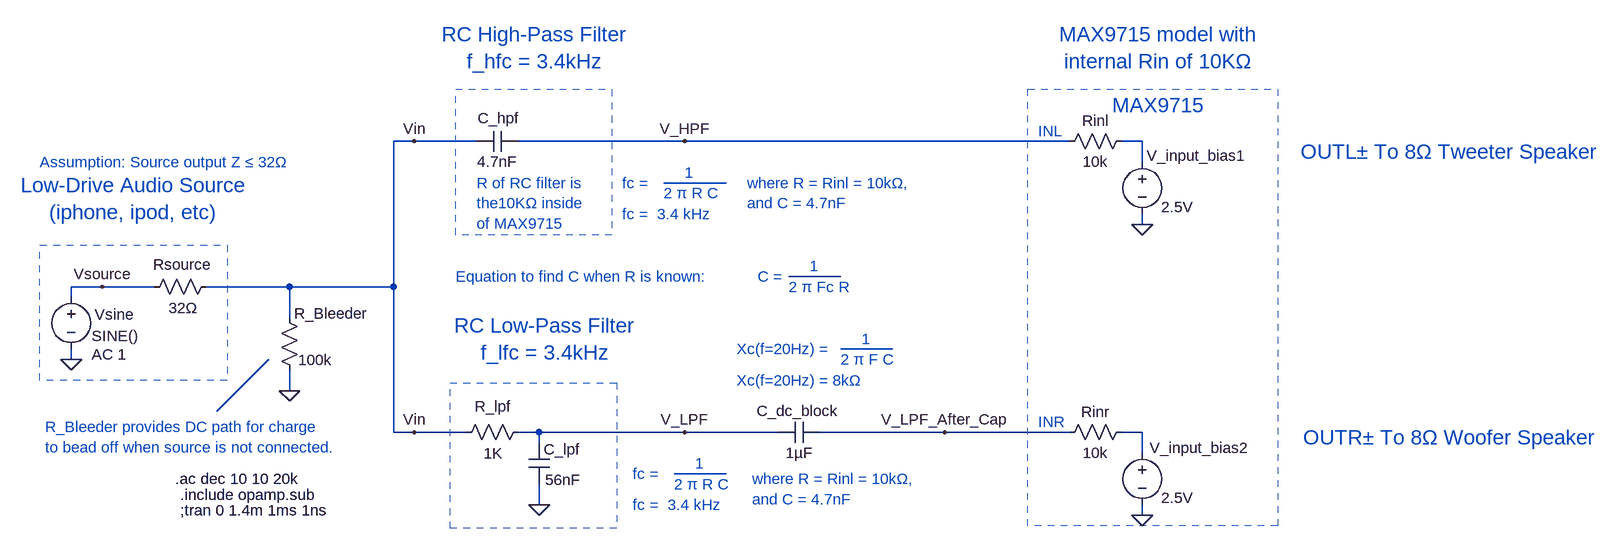
[diagram p0: schematic audio-crossover.asc]
audio-crossover.asc, the LTspice schematic file:
Version 4
SHEET 1 2344 2400
WIRE -1104 1648 -1136 1648
WIRE -1008 1648 -1104 1648
WIRE -688 1648 -944 1648
WIRE -96 1648 -688 1648
WIRE 16 1648 -16 1648
WIRE 16 1680 16 1648
WIRE -624 1712 -720 1712
WIRE 16 1776 16 1760
WIRE -448 1856 -528 1856
WIRE -1584 1872 -1632 1872
WIRE -1504 1872 -1584 1872
WIRE -1296 1872 -1424 1872
WIRE -1136 1872 -1136 1648
WIRE -1136 1872 -1296 1872
WIRE -1632 1888 -1632 1872
WIRE -1296 1920 -1296 1872
WIRE -368 1968 -448 1968
WIRE -1632 1984 -1632 1968
WIRE -1296 2032 -1296 2000
WIRE -1408 2064 -1328 1984
WIRE -1136 2096 -1136 1872
WIRE -1104 2096 -1136 2096
WIRE -1024 2096 -1104 2096
WIRE -912 2096 -944 2096
WIRE -688 2096 -912 2096
WIRE -544 2096 -688 2096
WIRE -288 2096 -480 2096
WIRE -96 2096 -288 2096
WIRE 16 2096 -16 2096
WIRE -912 2112 -912 2096
WIRE 16 2128 16 2096
WIRE -624 2160 -704 2160
WIRE -912 2208 -912 2176
WIRE 16 2224 16 2208
FLAG -912 2208 0
FLAG -1632 1984 0
FLAG -1584 1872 Vsource
FLAG 16 1776 0
FLAG -1104 1648 Vin
FLAG -688 1648 V_HPF
FLAG -1104 2096 Vin
FLAG -688 2096 V_LPF
FLAG -1296 2032 0
FLAG 16 2224 0
FLAG -288 2096 V_LPF_After_Cap
SYMBOL cap -928 2112 R0
WINDOW 3 25 57 Left 2
WINDOW 0 23 10 Left 2
SYMATTR Value 56nF
SYMATTR InstName C_lpf
SYMBOL res -928 2080 R90
WINDOW 0 -8 55 VBottom 2
WINDOW 3 33 55 VTop 2
SYMATTR InstName R_lpf
SYMATTR Value 1K
SYMBOL voltage -1632 1872 R0
WINDOW 0 36 43 Left 2
WINDOW 3 32 76 Left 2
WINDOW 123 32 104 Left 2
WINDOW 39 0 0 Left 0
SYMATTR InstName Vsine
SYMATTR Value SINE()
SYMATTR Value2 AC 1
SYMBOL res -1408 1856 R90
WINDOW 0 -3 53 VBottom 2
WINDOW 3 33 51 VTop 2
SYMATTR InstName Rsource
SYMATTR Value 32Ω
SYMBOL cap -944 1632 R90
WINDOW 3 32 32 VTop 2
WINDOW 0 -4 30 VBottom 2
SYMATTR Value 4.7nF
SYMATTR InstName C_hpf
SYMBOL cap -480 2080 R90
WINDOW 0 -1 34 VBottom 2
WINDOW 3 32 32 VTop 2
SYMATTR InstName C_dc_block
SYMATTR Value 1µF
SYMBOL res -1312 1904 R0
WINDOW 0 23 9 Left 2
WINDOW 3 29 81 Left 2
SYMATTR InstName R_Bleeder
SYMATTR Value 100k
SYMBOL res 0 1632 R90
WINDOW 0 0 56 VBottom 2
WINDOW 3 32 56 VTop 2
SYMATTR InstName Rinl
SYMATTR Value 10k
SYMBOL voltage 16 1664 R0
WINDOW 0 7 6 Left 2
WINDOW 3 29 85 Left 2
WINDOW 123 0 0 Left 0
WINDOW 39 0 0 Left 0
SYMATTR InstName V_input_bias1
SYMATTR Value 2.5V
SYMBOL res 0 2080 R90
WINDOW 0 0 56 VBottom 2
WINDOW 3 32 56 VTop 2
SYMATTR InstName Rinr
SYMATTR Value 10k
SYMBOL voltage 16 2112 R0
WINDOW 0 11 8 Left 2
WINDOW 3 29 85 Left 2
WINDOW 123 0 0 Left 0
WINDOW 39 0 0 Left 0
SYMATTR InstName V_input_bias2
SYMATTR Value 2.5V
TEXT 40 1504 Center 3 ;MAX9715 model with\ninternal Rin of 10KΩ
TEXT -1536 1736 Center 3 ;Low-Drive Audio Source\n(iphone, ipod, etc)
TEXT -920 1504 Center 3 ;RC High-Pass Filter\nf_hfc = 3.4kHz
TEXT -784 1712 Left 2 ;fc =
TEXT -688 1696 Left 2 ;1
TEXT -720 1728 Left 2 ;2 π R C
TEXT -784 1760 Left 2 ;fc =  3.4 kHz
TEXT 40 1592 Center 3 ;MAX9715
TEXT 488 1664 Center 3 ;OUTL± To 8Ω Tweeter Speaker
TEXT -1472 2168 Left 2 !.ac dec 10 10 20k
TEXT -1464 2192 Left 2 !.include opamp.sub
TEXT -1464 2216 Left 2 !;tran 0 1.4m 1ms 1ns
TEXT -904 1952 Center 3 ;RC Low-Pass Filter\nf_lfc = 3.4kHz
TEXT -768 2160 Left 2 ;fc =
TEXT -672 2144 Left 2 ;1
TEXT -704 2176 Left 2 ;2 π R C
TEXT -768 2208 Left 2 ;fc =  3.4 kHz
TEXT 488 2104 Center 3 ;OUTR± To 8Ω Woofer Speaker
TEXT -608 1968 Left 2 ;Xc(f=20Hz) =
TEXT -448 1984 Left 2 ;2 π F C
TEXT -416 1952 Left 2 ;1
TEXT -608 2016 Left 2 ;Xc(f=20Hz) = 8kΩ
TEXT -1672 2088 Left 2 ;R_Bleeder provides DC path for charge\nto bead off when source is not connected.
TEXT -144 1632 Left 2 ;INL
TEXT -144 2080 Left 2 ;INR
TEXT -592 1712 Left 2 ;where R = Rinl = 10kΩ,\nand C = 4.7nF
TEXT -1008 1712 Left 2 ;R of RC filter is\nthe10KΩ inside\nof MAX9715
TEXT -584 2168 Left 2 ;where R = Rinl = 10kΩ,\nand C = 4.7nF
TEXT -1040 1856 Left 2 ;Equation to find C when R is known:
TEXT -576 1856 Left 2 ;C =
TEXT -528 1872 Left 2 ;2 π Fc R
TEXT -496 1840 Left 2 ;1
TEXT -1680 1680 Left 2 ;Assumption: Source output Z ≤ 32Ω
LINE Normal -1552 1808 -1552 1808 2
LINE Normal -1552 1808 -1552 1808 2
RECTANGLE Normal -1392 2016 -1680 1808 2
RECTANGLE Normal -800 1792 -1040 1568 2
RECTANGLE Normal 224 2240 -160 1568 2
RECTANGLE Normal -793 2244 -1049 2020 2

The netlist it stands for:
* audio-crossover.asc
C_lpf V_LPF 0 56nF
R_lpf V_LPF Vin 1K
Vsine Vsource 0 SINE() AC 1
Rsource Vin Vsource 32Ω
C_hpf V_HPF Vin 4.7nF
C_dc_block V_LPF_After_Cap V_LPF 1µF
R_Bleeder Vin 0 100k
Rinl N001 V_HPF 10k
V_input_bias1 N001 0 2.5V
Rinr N006 V_LPF_After_Cap 10k
V_input_bias2 N006 0 2.5V
* MAX9715 model with
* internal Rin of 10KΩ
* Low-Drive Audio Source
* (iphone, ipod, etc)
* RC High-Pass Filter
* f_hfc = 3.4kHz
* fc =
* 1
* 2 π R C
* fc =  3.4 kHz
* MAX9715
* OUTL± To 8Ω Tweeter Speaker
.ac dec 10 10 20k
.include opamp.sub
;tran 0 1.4m 1ms 1ns
* RC Low-Pass Filter
* f_lfc = 3.4kHz
* fc =
* 1
* 2 π R C
* fc =  3.4 kHz
* OUTR± To 8Ω Woofer Speaker
* Xc(f=20Hz) =
* 2 π F C
* 1
* Xc(f=20Hz) = 8kΩ
* R_Bleeder provides DC path for charge
* to bead off when source is not connected.
* INL
* INR
* where R = Rinl = 10kΩ,
* and C = 4.7nF
* R of RC filter is
* the10KΩ inside
* of MAX9715
* where R = Rinl = 10kΩ,
* and C = 4.7nF
* Equation to find C when R is known:
* C =
* 2 π Fc R
* 1
* Assumption: Source output Z ≤ 32Ω
.backanno
.end